# Altium project Arduino Nano.PrjPcb
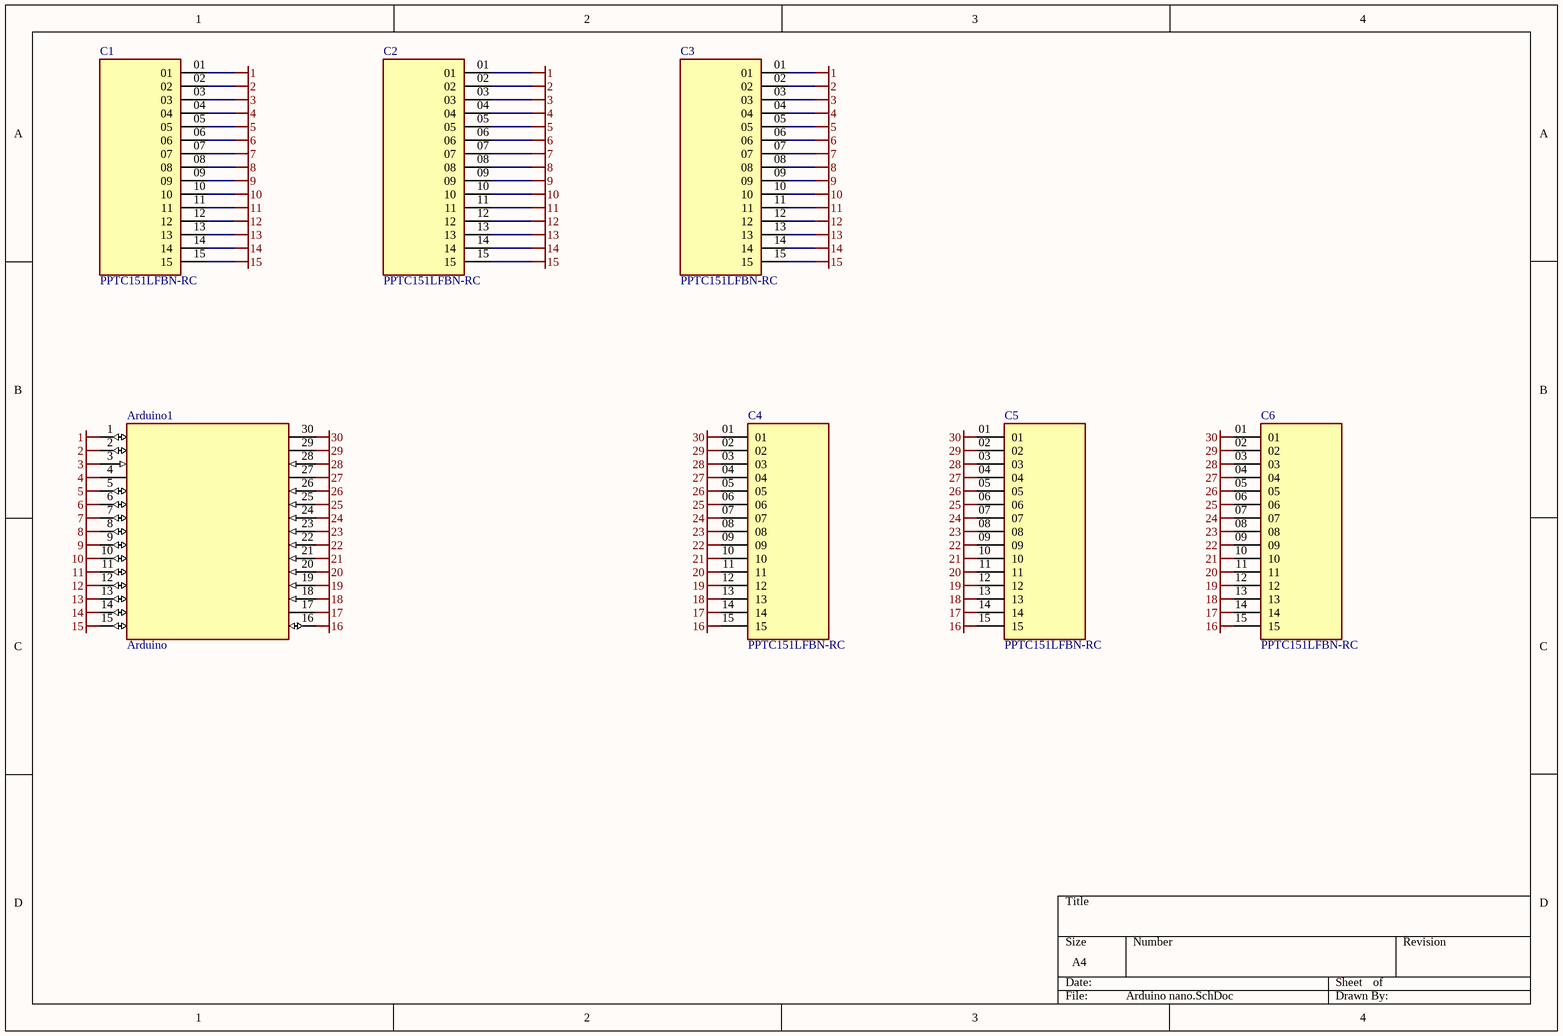
[diagram p0: Arduino nano.SchDoc]
1 sheet, 7 parts. Net scope: global (net labels, ports and power ports of the same name join across sheets).
Board file: Arduino Nano.PcbDoc

## Sheet Arduino nano.SchDoc
size A4; SheetNumber: 1; SheetTotal: 1

### Parts
Arduino1  Arduino  [MODULE_A000005]
C1  PPTC151LFBN-RC  [SAMTEC_DW-15-12-G-S-807]
C2  PPTC151LFBN-RC  [SAMTEC_DW-15-12-G-S-807]
C3  PPTC151LFBN-RC  [SAMTEC_DW-15-12-G-S-807]
C4  PPTC151LFBN-RC  [SAMTEC_DW-15-12-G-S-807]
C5  PPTC151LFBN-RC  [SAMTEC_DW-15-12-G-S-807]
C6  PPTC151LFBN-RC  [SAMTEC_DW-15-12-G-S-807]

### Nets
1: Arduino1.1(D0/TX) C1.01 C2.01 C3.01
2: Arduino1.2(D1/RX) C1.02 C2.02 C3.02
3: Arduino1.3(RESET_1) C1.03 C2.03 C3.03
4: Arduino1.4(GND_1) C1.04 C2.04 C3.04
5: Arduino1.5(D2) C1.05 C2.05 C3.05
6: Arduino1.6(D3) C1.06 C2.06 C3.06
7: Arduino1.7(D4) C1.07 C2.07 C3.07
8: Arduino1.8(D5) C1.08 C2.08 C3.08
9: Arduino1.9(D6) C1.09 C2.09 C3.09
10: Arduino1.10(D7) C1.10 C2.10 C3.10
11: Arduino1.11(D8) C1.11 C2.11 C3.11
12: Arduino1.12(D9) C1.12 C2.12 C3.12
13: Arduino1.13(D10) C1.13 C2.13 C3.13
14: Arduino1.14(D11) C1.14 C2.14 C3.14
15: Arduino1.15(D12) C1.15 C2.15 C3.15
16: Arduino1.16(D13) C4.15 C5.15 C6.15
17: Arduino1.17(3V3) C4.14 C5.14 C6.14
18: Arduino1.18(AREF) C4.13 C5.13 C6.13
19: Arduino1.19(A0) C4.12 C5.12 C6.12
20: Arduino1.20(A1) C4.11 C5.11 C6.11
21: Arduino1.21(A2) C4.10 C5.10 C6.10
22: Arduino1.22(A3) C4.09 C5.09 C6.09
23: Arduino1.23(A4) C4.08 C5.08 C6.08
24: Arduino1.24(A5) C4.07 C5.07 C6.07
25: Arduino1.25(A6) C4.06 C5.06 C6.06
26: Arduino1.26(A7) C4.05 C5.05 C6.05
27: Arduino1.27(5V) C4.04 C5.04 C6.04
28: Arduino1.28(RESET_2) C4.03 C5.03 C6.03
29: Arduino1.29(GND_2) C4.02 C5.02 C6.02
30: Arduino1.30(VIN) C4.01 C5.01 C6.01

### Library data of the parts
Arduino1 = A000005: Supplier: Digikey; Supplier Part Number: 1050-1001-ND; Manufacturer: Arduino; Manufacturer Part Number: A000005; RoHS: Yes; Category: Embedded Processors and Controllers; Stock: 1289; Pricing: 1=24.9 (USD); ComponentLink1URL: https://datasheet.ciiva.com/2398/arduinonanomanual23-2398236.pdf?src-supplier=Digikey; ComponentLink1Description: https://datasheet.ciiva.com/2398/arduinonanomanual23-2398236.pdf?src-supplier=Digikey; ComponentLink2URL: https://datasheet.ciiva.com/4926/arduino-arduinoboardnano-188748-4926316.pdf?src-supplier=Mouser; ComponentLink2Description: https://datasheet.ciiva.com/4926/arduino-arduinoboardnano-188748-4926316.pdf?src-supplier=Mouser; ComponentLink3URL: https://datasheet.ciiva.com/1414/810078-1414124.pdf?src-supplier=Newark; ComponentLink3Description: https://datasheet.ciiva.com/1414/810078-1414124.pdf?src-supplier=Newark; ComponentLink4URL: https://datasheet.ciiva.com/1336/1682238-1336473.pdf?src-supplier=Element14; ComponentLink4Description: https://datasheet.ciiva.com/1336/1682238-1336473.pdf?src-supplier=Element14; ComponentLink5URL: https://datasheet.ciiva.com/19455/2121148-19455443.pdf?src-supplier=Jameco; ComponentLink5Description: https://datasheet.ciiva.com/19455/2121148-19455443.pdf?src-supplier=Jameco
C1-C6 = PPTC151LFBN-RC: Board Connector, 15 Contact(s), 1 Row(s), Female, Straight, 0.1 inch Pitch, Solder Terminal, Locking; Manufacturer: Sullins; Manufacturer Series: PP; Contact Pattern: RECTANGULAR; Contact Style: SQ PIN-SKT; Number Of Connectors: 1; Rated Current (Signal): 3A; Number of Contacts: 15; Polarization Key: POLARIZED HOUSING; Body Breadth: 0.094inch; Body Depth: 0.334inch; Body Length: 1.52inch; Reference Standard: UL; Reliability: COMMERCIAL; Supplier: Digikey; Supplier Part Number: S7013-ND; Manufacturer Part Number: PPTC151LFBN-RC; RoHS: Yes; Category: Headers and Wire Housings; Stock: 14275; Pricing: 1=0.99, 10=0.836, 80=0.75075, 440=0.61425, 1000=0.546, 5000=0.4875 (USD); Mounting Technology: Board; Contact Material: Bronze; Contact Finish - Mating: SN; Contact Finish - Termination: TIN; Insulation Material: Polyester; Connector Type: BOARD CONNECTOR; Contact Gender: Female; Mounting Style: STRAIGHT; Number Of PCB Rows: 1; Number of Rows Loaded: 1; Termination: Solder; PCB Contact Pattern: RECTANGULAR; Mating Contact Pitch: 0.1inch; Terminal Length: 0.125inch; Terminal Pitch: 2.54mm; Mounting Option 1: LOCKING; Reach SVHC Compliant: Yes; RoHS Compliant: Yes; ComponentLink1URL: https://datasheet.ciiva.com:443/pdfs/VipMasterIC/IC/SUCS/SUCSS00270/SUCSS00270-1.pdf?src-supplier=IHS+Markit; ComponentLink1Description: https://datasheet.ciiva.com:443/pdfs/VipMasterIC/IC/SUCS/SUCSS00270/SUCSS00270-1.pdf?src-supplier=IHS+Markit; ComponentLink2URL: https://media.digikey.com/pdf/Data%20Sheets/Sullins%20PDFs/Female_Headers.100_DS.pdf?src-supplier=Digikey; ComponentLink2Description: https://media.digikey.com/pdf/Data%20Sheets/Sullins%20PDFs/Female_Headers.100_DS.pdf?src-supplier=Digikey